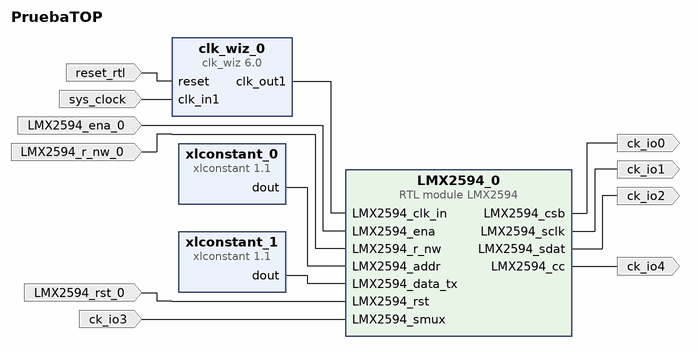
[diagram p0: block diagram of the top level]
# Vivado block design PruebaTOP, xc7z020clg400-1, Vivado 2024.1
create_bd_design PruebaTOP

create_bd_port -dir O ck_io0
create_bd_port -dir O ck_io1
create_bd_port -dir O ck_io2
create_bd_port -dir I ck_io3
create_bd_port -dir I -type clk sys_clock
set_property -dict {CONFIG.ASSOCIATED_RESET LMX2594_rst_0 CONFIG.FREQ_HZ 125000000 CONFIG.PHASE 0.0} [get_bd_ports sys_clock]
create_bd_port -dir I -type rst reset_rtl
set_property -dict {CONFIG.POLARITY ACTIVE_HIGH} [get_bd_ports reset_rtl]
create_bd_port -dir I LMX2594_ena_0
create_bd_port -dir I -type rst LMX2594_rst_0
create_bd_port -dir I LMX2594_r_nw_0
create_bd_port -dir O ck_io4

create_bd_cell -type module -reference LMX2594 LMX2594_0
create_bd_cell -type ip -vlnv xilinx.com:ip:clk_wiz:6.0 clk_wiz_0
set_property -dict [list \
  CONFIG.CLKIN1_JITTER_PS 80.0 \
  CONFIG.CLKOUT1_JITTER 124.615 \
  CONFIG.CLKOUT1_PHASE_ERROR 96.948 \
  CONFIG.CLK_IN1_BOARD_INTERFACE sys_clock \
  CONFIG.MMCM_CLKFBOUT_MULT_F 8.000 \
  CONFIG.MMCM_CLKIN1_PERIOD 8.000 \
  CONFIG.USE_BOARD_FLOW true \
] [get_bd_cells clk_wiz_0]
create_bd_cell -type ip -vlnv xilinx.com:ip:xlconstant:1.1 xlconstant_0
set_property -dict {CONFIG.CONST_VAL 0x55 CONFIG.CONST_WIDTH 7} [get_bd_cells xlconstant_0]
create_bd_cell -type ip -vlnv xilinx.com:ip:xlconstant:1.1 xlconstant_1
set_property -dict {CONFIG.CONST_VAL 0xAAAA CONFIG.CONST_WIDTH 16} [get_bd_cells xlconstant_1]

# ---- connections ----

connect_bd_net [get_bd_pins LMX2594_0/LMX2594_cc] [get_bd_ports ck_io4]
connect_bd_net [get_bd_pins LMX2594_0/LMX2594_csb] [get_bd_ports ck_io0]
connect_bd_net [get_bd_pins LMX2594_0/LMX2594_sclk] [get_bd_ports ck_io1]
connect_bd_net [get_bd_pins LMX2594_0/LMX2594_sdat] [get_bd_ports ck_io2]
connect_bd_net -net LMX2594_ena_0_1 [get_bd_ports LMX2594_ena_0] [get_bd_pins LMX2594_0/LMX2594_ena]
connect_bd_net -net LMX2594_r_nw_0_1 [get_bd_ports LMX2594_r_nw_0] [get_bd_pins LMX2594_0/LMX2594_r_nw]
connect_bd_net -net LMX2594_rst_0_1 [get_bd_ports LMX2594_rst_0] [get_bd_pins LMX2594_0/LMX2594_rst]
connect_bd_net -net LMX2594_smux_0_1 [get_bd_ports ck_io3] [get_bd_pins LMX2594_0/LMX2594_smux]
connect_bd_net [get_bd_pins clk_wiz_0/clk_out1] [get_bd_pins LMX2594_0/LMX2594_clk_in]
connect_bd_net [get_bd_ports reset_rtl] [get_bd_pins clk_wiz_0/reset]
connect_bd_net [get_bd_ports sys_clock] [get_bd_pins clk_wiz_0/clk_in1]
connect_bd_net [get_bd_pins xlconstant_0/dout] [get_bd_pins LMX2594_0/LMX2594_addr]
connect_bd_net [get_bd_pins xlconstant_1/dout] [get_bd_pins LMX2594_0/LMX2594_data_tx]

validate_bd_design
save_bd_design
